# Altium schematic sheet Sheet1.SchDoc
size A3
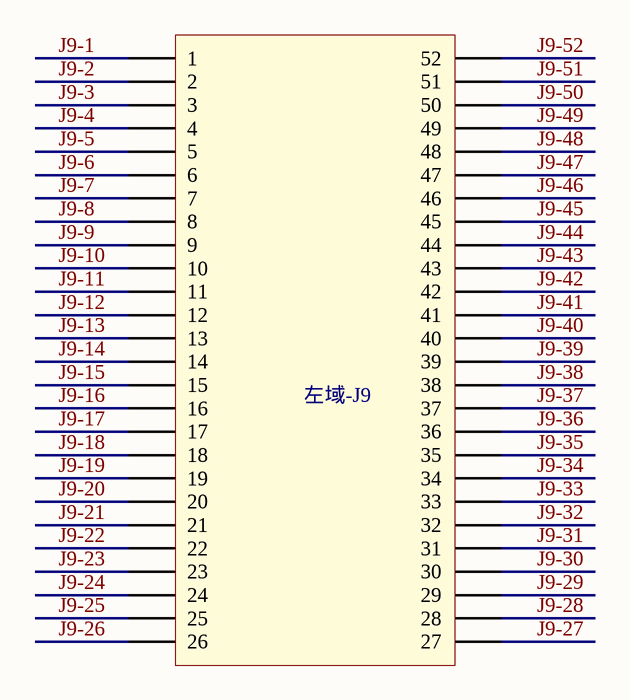
[diagram p0: Sheet1.SchDoc]

## Parts
*  左域-J9

## Nets
J9-1: *.1
J9-2: *.2
J9-3: *.3
J9-4: *.4
J9-5: *.5
J9-6: *.6
J9-7: *.7
J9-8: *.8
J9-9: *.9
J9-10: *.10
J9-11: *.11
J9-12: *.12
J9-13: *.13
J9-14: *.14
J9-15: *.15
J9-16: *.16
J9-17: *.17
J9-18: *.18
J9-19: *.19
J9-20: *.20
J9-21: *.21
J9-22: *.22
J9-23: *.23
J9-24: *.24
J9-25: *.25
J9-26: *.26
J9-27: *.27
J9-28: *.28
J9-29: *.29
J9-30: *.30
J9-31: *.31
J9-32: *.32
J9-33: *.33
J9-34: *.34
J9-35: *.35
J9-36: *.36
J9-37: *.37
J9-38: *.38
J9-39: *.39
J9-40: *.40
J9-41: *.41
J9-42: *.42
J9-43: *.43
J9-44: *.44
J9-45: *.45
J9-46: *.46
J9-47: *.47
J9-48: *.48
J9-49: *.49
J9-50: *.50
J9-51: *.51
J9-52: *.52

## Library data of the parts
* = 左域-J4